# EasyEDA Pro project ProDocument_LTC2220_ADA_V1_2025-01-04.epro

# Schematic Schematic1
Create Date: 2023-09-23; Page Name: P1; Project Name: STI_Project; Schematic Name: Schematic1; Update Date: 2023-11-09; Company: 嘉立创EDA; Page Size: A4; Version: V1.0
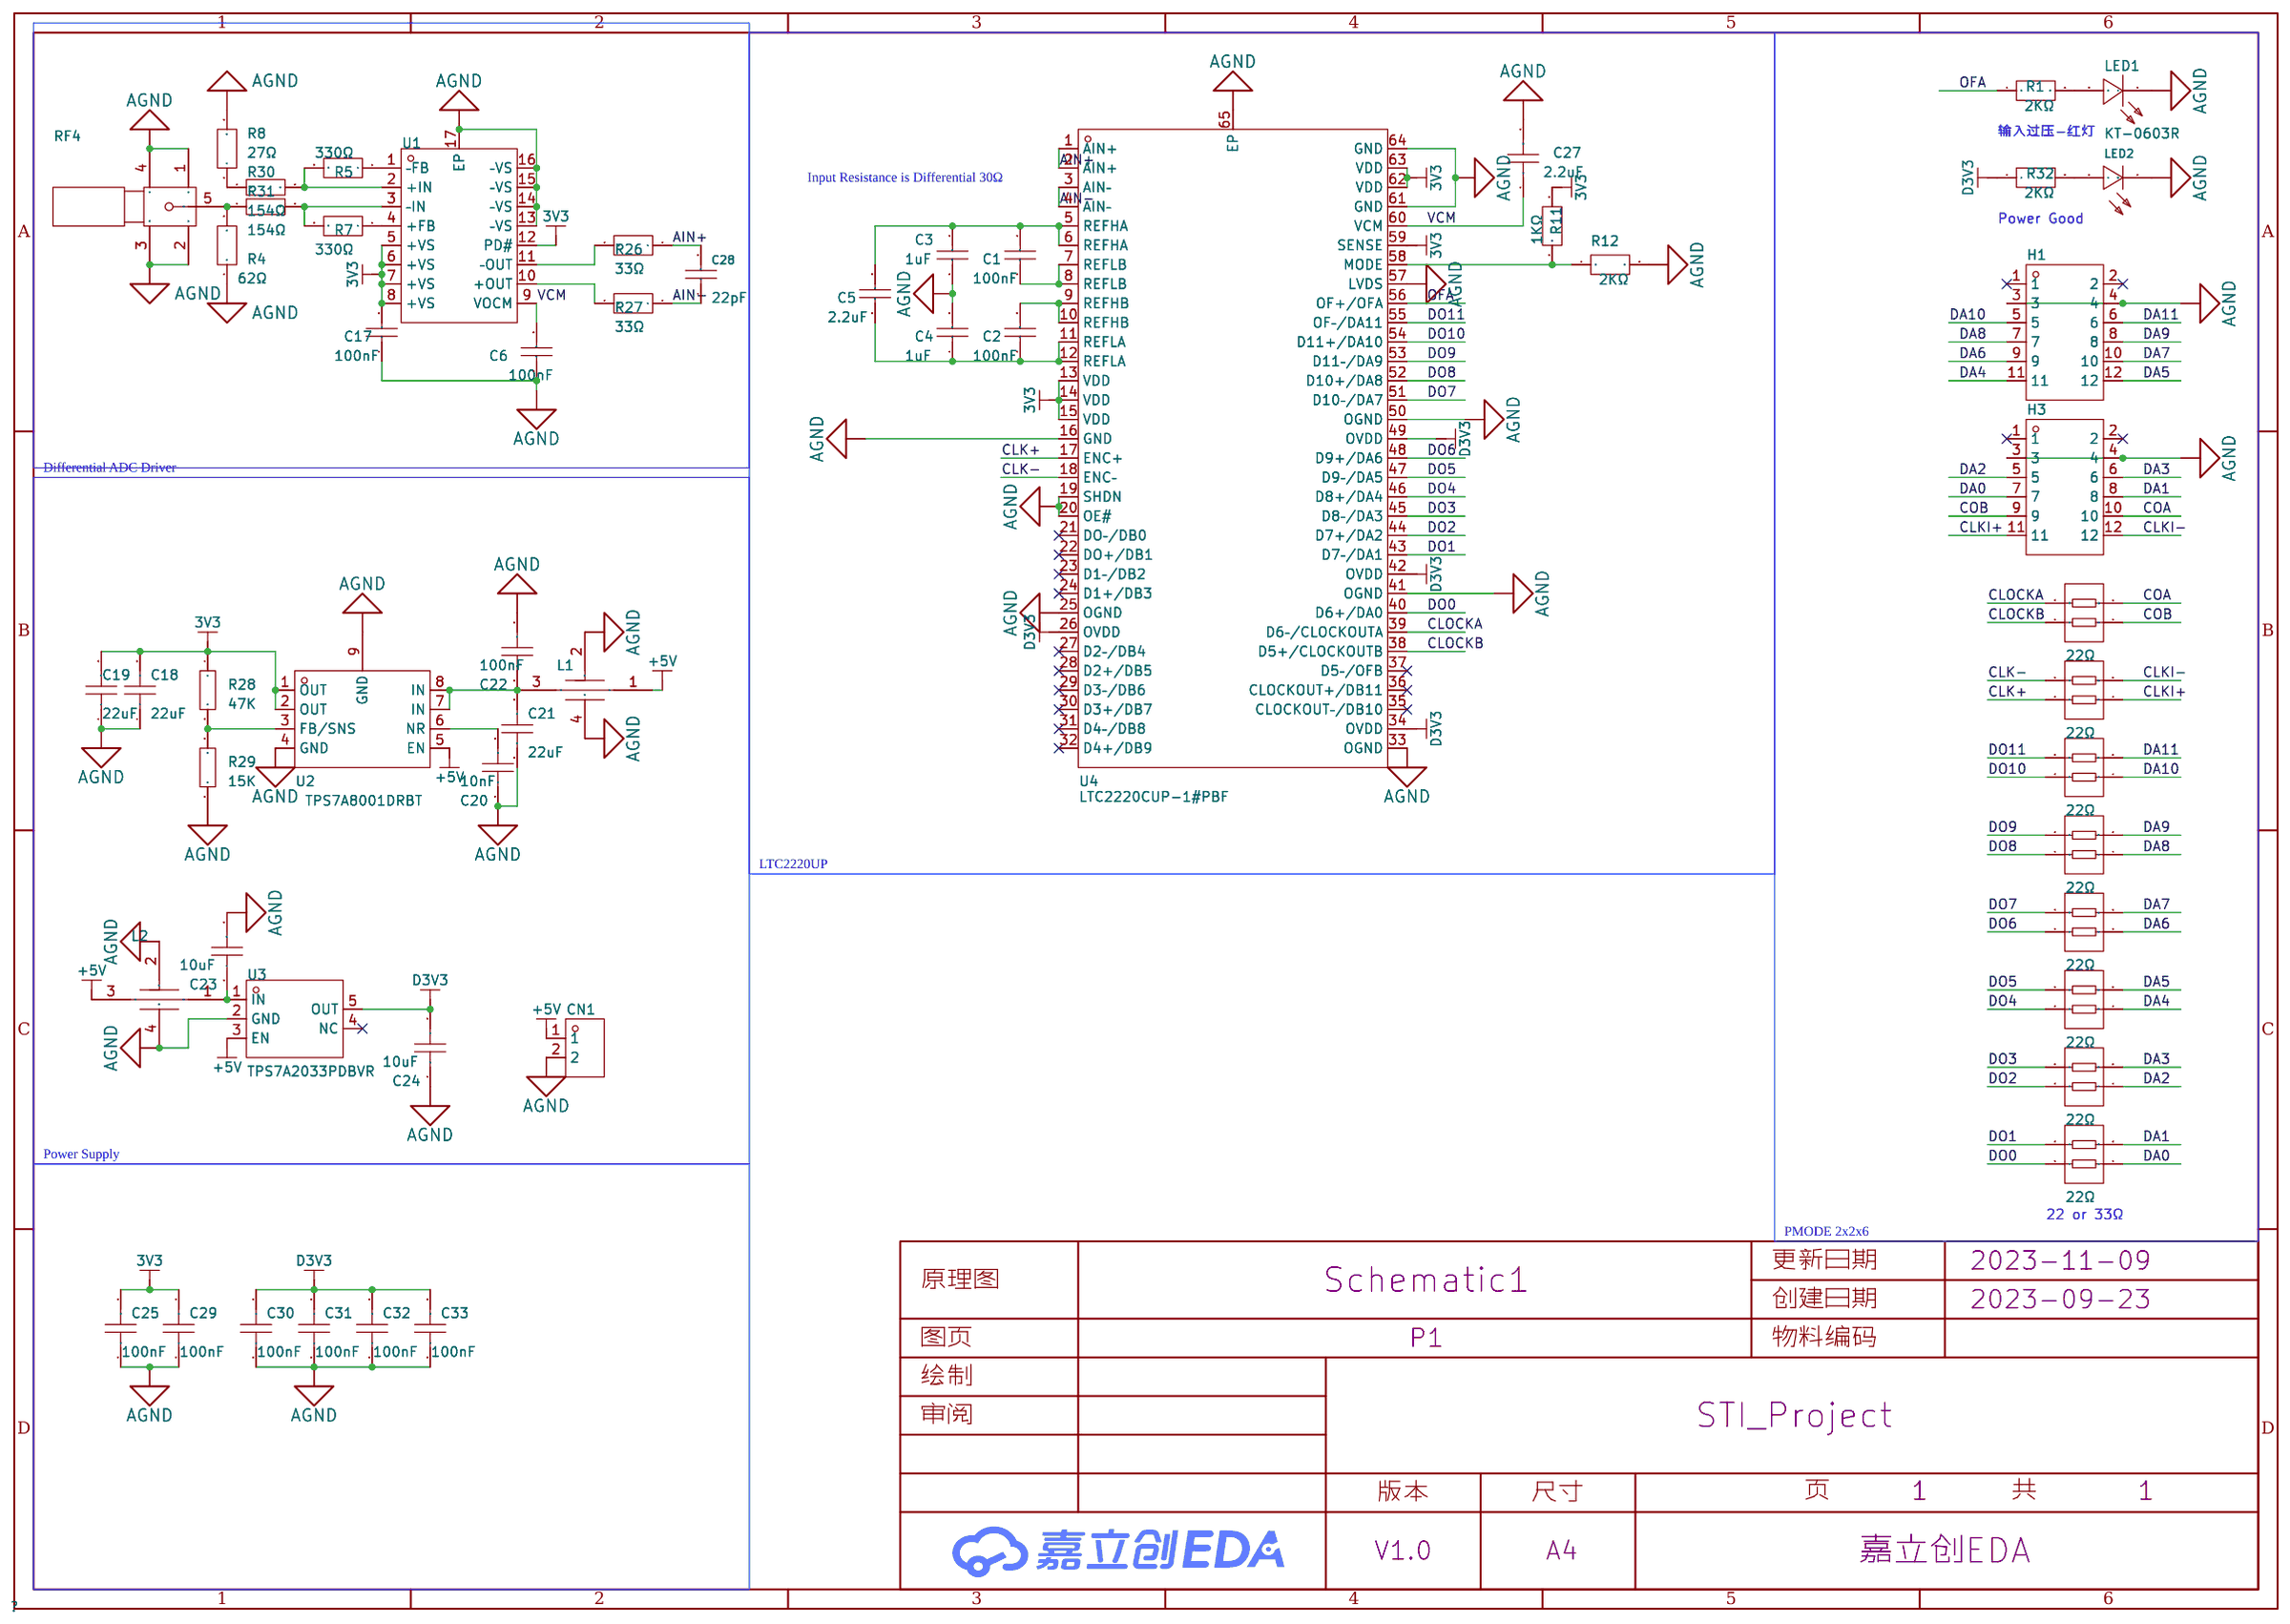
[diagram p0: schematic sheet]

## Parts
C1  100nF  [C0402]
C2  100nF  [C0402]
C3  1uF  [C0402]
C4  1uF  [C0402]
C5  2.2uF  [C0402]
C6  100nF  [C0402]
C17  100nF  [C0402]
C18  22uF  [C0805]
C19  22uF  [C0805]
C20  10nF  [C0603]
C21  22uF  [C0805]
C22  100nF  [C0603]
C23  10uF  [C0603]
C24  10uF  [C0603]
C25  100nF  [C0402]
C27  2.2uF  [C0603]
C28  22pF  [C0402]
C29  100nF  [C0402]
C30  100nF  [C0402]
C31  100nF  [C0402]
C32  100nF  [C0402]
C33  100nF  [C0402]
CN1  M2510V-02P  [CONN-TH_M2510V-02P]
H1  DZ254W-22-12-69  [HDR-TH_12P-P2.54-H-M-R2-C6-S2.54-W12.5]
H3  DZ254W-22-12-69  [HDR-TH_12P-P2.54-H-M-R2-C6-S2.54-W12.5]
L1  NFM21PC104R1E3D  [CAP-SMD_4P-L2.0-W1.25]
L2  NFM21PC104R1E3D  [CAP-SMD_4P-L2.0-W1.25]
LED1  KT-0603R  [LED0603-RD]
LED2  19-217/GHC-YR1S2/3T  [LED0603-RD]
R1  2KΩ  [R0402]
R4  62Ω  [R0402]
R5  330Ω  [R0402]
R7  330Ω  [R0402]
R8  27Ω  [R0402]
R11  1KΩ  [R0402]
R12  2KΩ  [R0402]
R26  33Ω  [R0402]
R27  33Ω  [R0402]
R28  47K  [R0402]
R29  15K  [R0402]
R30  154Ω  [R0402]
R31  154Ω  [R0402]
R32  2KΩ  [R0402]
RF4  KH-SMA-KE5.4  [SMA-TH_KH-SMA-KE-Z]
RN1  22Ω  [RES-ARRAY-SMD_0402-4P-L1.0-W1.0-BL]
RN2  22Ω  [RES-ARRAY-SMD_0402-4P-L1.0-W1.0-BL]
RN3  22Ω  [RES-ARRAY-SMD_0402-4P-L1.0-W1.0-BL]
RN4  22Ω  [RES-ARRAY-SMD_0402-4P-L1.0-W1.0-BL]
RN5  22Ω  [RES-ARRAY-SMD_0402-4P-L1.0-W1.0-BL]
RN6  22Ω  [RES-ARRAY-SMD_0402-4P-L1.0-W1.0-BL]
RN7  22Ω  [RES-ARRAY-SMD_0402-4P-L1.0-W1.0-BL]
RN8  22Ω  [RES-ARRAY-SMD_0402-4P-L1.0-W1.0-BL]
U1  ADA4937-1YCPZ-RL  [LFCSP-16_L3.0-W3.0-P0.50-BL-EP1.3]
U2  TPS7A8001DRBT  [SON-8_L3.0-W3.0-P0.65-BL-EP]
U3  TPS7A2033PDBVR  [SOT-23-5_L2.9-W1.6-P0.95-LS2.8-BR]
U4  LTC2220CUP-1#PBF  [QFN-64_L9.0-W9.0-P0.50-BL-EP7.2]

## Library data of the parts
C1-C6 C17 = GCM155R71C104KA40D: 容值:100nF;精度:±10%;额定电压:16V;材质(温度系数):X7R;; LCSC Part Name: 100nF ±10% 16V; Supplier Part: C126523; Manufacturer: muRata(村田); Supplier Footprint: 0402; JLCPCB Part Class: Extended Part; Datasheet: https://atta.szlcsc.comnull; Supplier: LCSC; Tolerance: ±10%; Voltage Rated: 16V; Temperature Coefficient: X7R
C18 C19 C21 = CL21A226MAQNNNE_C45783: 容值:22uF;精度:±20%;额定电压:25V;材质(温度系数):X5R;; LCSC Part Name: 22uF ±20% 25V; Supplier Part: C45783; Manufacturer: SAMSUNG(三星); Manufacturer Part: CL21A226MAQNNNE; Supplier Footprint: 0805; JLCPCB Part Class: 基础库; Datasheet: https://atta.szlcsc.com/upload/public/pdf/source/20160103/1457707727161.pdf; Supplier: LCSC; Tolerance: ±20%; Voltage Rated: 25V; Temperature Coefficient: X5R
C20 C22-C24 C27 = CAP_0603: Supplier Footprint: 0603
C25 C29-C33 = CAP_0402: Supplier Footprint: 0402
C28 = 0402CG220J500NT: 容值:22pF;精度:±5%;额定电压:50V;材质(温度系数):C0G;; LCSC Part Name: 22pF ±5% 50V; Supplier Part: C1555; Manufacturer: FH(风华); Supplier Footprint: 0402; JLCPCB Part Class: 基础库; Datasheet: https://atta.szlcsc.com/upload/public/pdf/source/20200305/C486355_26A10D38EF8C2A5C37091D0039909270.pdf; Supplier: LCSC; Tolerance: ±5%; Voltage Rated: 50V; Temperature Coefficient: C0G
CN1 = M2510V-02P: 参考系列:-;间距:2.54mm;插针结构:1x2P;排数:1;每排PIN数:2;行距:-;公母:公型插针;安装方式:直插;额定电流:3A;工作温度范围:-25~+85;; LCSC Part Name: 2P 2.54mm; Supplier Part: C2764790; Manufacturer: XFCN(台湾兴飞); Supplier Footprint: 插件,P=2.54mm; JLCPCB Part Class: Extended Part; Datasheet: https://atta.szlcsc.com/upload/public/pdf/source/20210810/3DC46818253F58AEF0903D89F89BDDDF.pdf; Supplier: LCSC; Pitch: 2.54mm; Pins Structure: 1x2P; Number of Rows: 1; Number of PINs Per Row: 2; Gender: 公型插针; Mounting Style: 直插; Current Rating (Max): 3A; Operating Temperature Range: -25~+85
H1 H3 = DZ254W-22-12-69: 间距:2.54mm;总PIN位数:12;排数:2;插针结构:2x6P;行距:2.54mm;安装类型:弯插;圆针/方针:方针;额定电流:3A;额定电压:-;配合针长度:6mm;塑高:2.54mm;端接针长度:-;工作温度范围:-;颜色:-;; LCSC Part Name: 2.54mm 2x6P 弯插 方针; Supplier Part: C2935938; Manufacturer: DEALON(德艺隆); Supplier Footprint: 弯插,P=2.54mm; JLCPCB Part Class: Extended Part; Datasheet: https://atta.szlcsc.com/upload/public/pdf/source/20211231/A9EB3FEFD92C329C455814A6A34A72A7.pdf; Supplier: LCSC; Pitch: 2.54mm; Number of Pins: 12; Number of Rows: 2; Pin Structure: 2x6P; Row Spacing: 2.54mm; Mounting Type: 弯插; Circluar Pins/Square Pins: 方针; Current Rating (Max): 3A; Length of Mating Pin: 6mm; Insulation Height: 2.54mm
L1 L2 = NFM21PC104R1E3D: 电容量:100nF;精度:±20%;直流电阻:30mΩ;; LCSC Part Name: 100nF(104) ±20% 25V; Supplier Part: C86150; Manufacturer: muRata(村田); Supplier Footprint: 0805; JLCPCB Part Class: 扩展库; Datasheet: https://atta.szlcsc.com/upload/public/pdf/source/20180326/C86150_E4B7366323682FA84DED9003C68CA797.pdf; Supplier: LCSC; Nominal Capacitance: 100nF; CapacitanceTolerance: ±20%; DC Rated Voltage: 25V; Rated Current: 2A; DC Resistance: 30mΩ; Operating Temperature: -55℃~+125℃
LED1 = KT-0603R: 发光颜色:红灯;二极管配置:-;透镜颜色:-;主波长:-;色温:-;功率:-;发光角度:-;安装方式:-;工作温度:-40℃~+85℃;; LCSC Part Name: 0603 红灯 高亮; Supplier Part: C2286; Manufacturer: KENTO; Supplier Footprint: 0603; JLCPCB Part Class: 基础库; Datasheet: https://atta.szlcsc.com/upload/public/pdf/source/20160616/1466072038404.pdf; Supplier: LCSC; Emitted Color: 红灯; Operating Temperature: -40℃~+85℃
LED2 = 19-217/GHC-YR1S2/3T: 发光颜色:翠绿;二极管配置:-;主波长:520nm~535nm;色温:-;功率:110mW;安装方式:-;; LCSC Part Name: 翠绿; Supplier Part: C72043; Manufacturer: EVERLIGHT(亿光); Supplier Footprint: 0603; JLCPCB Part Class: 基础库; Datasheet: https://atta.szlcsc.com/upload/public/pdf/source/20160507/1462613613780.pdf; Supplier: LCSC; Emitted Color: 翠绿; Lens Color: 无色透明; Dominant Wavelength: 520nm~535nm; Peak Wavelength: 518nm; Forward Current: 20mA; Power Dissipation: 110mW; Viewing Angle: 120°; Operating Temperature: -40℃~+85℃
R1 R4 R5 R7 R8 R11 R12 R26 R27 R32 = ARG02BTC1001: 阻值:1kΩ;精度:±0.1%;温度系数:±25ppm/;; LCSC Part Name: 1kΩ ±0.1%; Supplier Part: C2984405; Manufacturer: Viking(光颉); Supplier Footprint: 0402; Datasheet: https://atta.szlcsc.com/upload/public/pdf/source/20200117/C485675_99063924B4564AF910B7BE66DA8EFA49.pdf; Supplier: LCSC; Tolerance: ±0.1%; Temperature Coefficient: ±25ppm/
R28 R29 = Res_0402: Supplier Footprint: 0402
R30 R31 = AC0402FR-07154RL: 电阻类型:厚膜电阻;阻值:154Ω;精度:±1%;功率:62.5mW;; LCSC Part Name: 154Ω ±1% 62.5mW; Supplier Part: C226792; Manufacturer: YAGEO(国巨); Supplier Footprint: 0402; JLCPCB Part Class: 扩展库; Datasheet: https://atta.szlcsc.com/upload/public/pdf/source/20180927/C226792_CA4154DF169955A8D57D7DD1AB6791E3.pdf; Supplier: LCSC; Type: 厚膜电阻; Tolerance: ±1%; Power(Watts): 62.5mW; Temperature Coefficient: ±100ppm/℃; Overload Voltage (Max): 50V; Operating Temperature Range: -55℃~+155℃
RF4 = KH-SMA-KE5.4: SMA板端 SMA板端 镀金半牙正脚直插SMA母针板端L=16.8MM 牙长5.4MM; LCSC Part Name: SMA板端; Supplier Part: C5123111; Manufacturer: kinghelm(金航标); Datasheet: https://atta.szlcsc.com/upload/public/pdf/source/20220804/C995CCD46EDCE61B12815CDE505A137A.pdf; Supplier: LCSC
RN1-RN8 = 2D02WGF220JTCE: 阻值:22Ω;精度:±1%;单个元件功率:62.5mW;电阻器数:2;; LCSC Part Name: 22Ω ±1%; Supplier Part: C425360; Manufacturer: UNI-ROYAL(厚声); Supplier Footprint: 0402x2; JLCPCB Part Class: 扩展库; Datasheet: https://atta.szlcsc.com/upload/public/pdf/source/20190904/C425360_E9826517C193614D673ACACE9EAE53D9.pdf; Supplier: LCSC; Tolerance: ±1%; Power(Watts): 62.5mW; Number of Resistors: 2; Number of Pins: 4; Temperature Coefficient: ±200ppm/℃
U1 = ADA4937-1YCPZ-RL: ADC-驱动器-IC-数据采集-16-LFCSP-VQ（3x3）; Supplier Part: C654331; Manufacturer: ADI(亚德诺)/LINEAR; Supplier Footprint: LFCSP-16; JLCPCB Part Class: Extended Part; Datasheet: https://atta.szlcsc.com/upload/public/pdf/source/20220519/FA46AECF95EBC5BF60D11754C6F695C9.pdf; Supplier: LCSC
U2 = TPS7A8001DRBT: 输出类型:可调;输出极性:正;输出通道数:1;最大输入电压:6.5V;输出电压:0.8V~6V;压差:500mV@(1A);输出电流:1A;电源纹波抑制比(PSRR):63dB;; LCSC Part Name: 正 Vin=6.5V Vout=0.8V~6V 1A 63dB; Supplier Part: C427118; Manufacturer: TI(德州仪器); Supplier Footprint: SON-8; Datasheet: https://atta.szlcsc.com/upload/public/pdf/source/20190909/C427118_0994F850269DFD43F93363C66176E2B6.pdf; Supplier: LCSC; Output Type: 可调; Output Polarity: 正; Number of Outputs: 1; Maximum Input Voltage: 6.5V; Output Voltage: 0.8V~6V; Dropout Voltage: 500mV@(1A); Output Current: 1A; Power Supply Rejection Ratio (PSRR): 63dB
U3 = TPS7A2033PDBVR: Supplier Part: C2862740; Manufacturer: TI(德州仪器); Supplier Footprint: SOT-23-5; JLCPCB Part Class: 扩展库; Datasheet: https://atta.szlcsc.com/upload/public/pdf/source/20230221/9B73099824E408F4B24BD95C528A27ED.pdf; Supplier: LCSC
U4 = LTC2220CUP-1#PBF: A/D 位数:-;采样率（sps）:-;输入数:-;输入类型:-;; Supplier Part: C679555; Manufacturer: ADI(亚德诺)/LINEAR; Supplier Footprint: QFN-64; JLCPCB Part Class: 扩展库; Datasheet: https://atta.szlcsc.com/upload/public/pdf/source/20200820/C679555_F0847BF44789C8E170D57E90645020CF.pdf; Supplier: LCSC

## Nets
3V3: C17.2 C18.2 C19.2 C25.2 C29.2 R11.1 R28.1 U1.5(+VS) U1.6(+VS) U1.7(+VS) U1.8(+VS) U1.12(PD#) U2.1(OUT) U2.2(OUT) U4.13(VDD) U4.14(VDD) U4.15(VDD) U4.59(SENSE) U4.62(VDD) U4.63(VDD)
+5V: CN1.1 L1.1(IN) L2.3(OUT) U2.5(EN) U3.3(EN)
AGND: C3.1 C4.2 C6.1 C17.1 C18.1 C19.1 C20.1 C21.1 C22.2 C23.2 C24.1 C25.1 C27.2 C29.1 C30.1 C31.1 C32.1 C33.1 CN1.2 H1.3 H1.4 H3.3 H3.4 L1.2(GND) L1.4(GND) L2.2(GND) L2.4(GND) LED1.1(K) LED2.1(C) R4.1 R8.2 R12.2 R29.2 RF4.1 RF4.2 RF4.3 RF4.4 U1.13(–VS) U1.14(–VS) U1.15(–VS) U1.16(–VS) U1.17(EP) U2.4(GND) U2.9(GND) U3.2(GND) U4.16(GND) U4.19(SHDN) U4.20(OE#) U4.25(OGND) U4.33(OGND) U4.41(OGND) U4.50(OGND) U4.57(LVDS) U4.61(GND) U4.64(GND) U4.65(EP)
D3V3: C24.2 C30.2 C31.2 C32.2 C33.2 R32.1 U3.5(OUT) U4.26(OVDD) U4.34(OVDD) U4.42(OVDD) U4.49(OVDD)
AIN+: C28.2 R26.1 U4.1(AIN+) U4.2(AIN+)
AIN-: C28.1 R27.1 U4.3(AIN–) U4.4(AIN–)
CLK+: RN2.1 U4.17(ENC+)
CLK-: RN2.2 U4.18(ENC–)
CLKI+: H3.11 RN2.4
CLKI-: H3.12 RN2.3
CLOCKA: RN8.2 U4.39(D6–/CLOCKOUTA)
CLOCKB: RN8.1 U4.38(D5+/CLOCKOUTB)
COA: H3.10 RN8.3
COB: H3.9 RN8.4
DA0: H3.7 RN7.4
DA1: H3.8 RN7.3
DA2: H3.5 RN6.4
DA3: H3.6 RN6.3
DA4: H1.11 RN5.4
DA5: H1.12 RN5.3
DA6: H1.9 RN4.4
DA7: H1.10 RN4.3
DA8: H1.7 RN3.4
DA9: H1.8 RN3.3
DA10: H1.5 RN1.4
DA11: H1.6 RN1.3
DO0: RN7.1 U4.40(D6+/DA0)
DO1: RN7.2 U4.43(D7–/DA1)
DO2: RN6.1 U4.44(D7+/DA2)
DO3: RN6.2 U4.45(D8–/DA3)
DO4: RN5.1 U4.46(D8+/DA4)
DO5: RN5.2 U4.47(D9–/DA5)
DO6: RN4.1 U4.48(D9+/DA6)
DO7: RN4.2 U4.51(D10–/DA7)
DO8: RN3.1 U4.52(D10+/DA8)
DO9: RN3.2 U4.53(D11–/DA9)
DO10: RN1.1 U4.54(D11+/DA10)
DO11: RN1.2 U4.55(OF–/DA11)
OFA: R1.1 U4.56(OF+/OFA)
VCM: C6.2 C27.1 U1.9(VOCM) U4.60(VCM)
$1N11576: C1.1 U4.7(REFLB) U4.8(REFLB)
$1N11577: C2.2 U4.9(REFHB) U4.10(REFHB)
$1N11578: C1.2 C3.2 C5.2 U4.5(REFHA) U4.6(REFHA)
$1N11579: C2.1 C4.1 C5.1 U4.11(REFLA) U4.12(REFLA)
$1N11586: R5.1 U1.1(–FB)
$1N11587: R5.2 R30.2 U1.2(+IN)
$1N11588: R7.1 U1.4(+FB)
$1N11590: R7.2 R31.2 U1.3(–IN)
$1N11617: R11.2 R12.1 U4.58(MODE)
$1N11646: R4.2 R31.1 RF4.5
$1N11649: R27.2 U1.10(+OUT)
$1N11650: R26.2 U1.11(–OUT)
$1N12931: C21.2 C22.1 L1.3(OUT) U2.7(IN) U2.8(IN)
$1N13030: R28.2 R29.1 U2.3(FB/SNS)
$1N13493: C20.2 U2.6(NR)
$1N13643: C23.1 L2.1(IN) U3.1(IN)
$1N14199: R8.1 R30.1
$1N14652: LED1.2(A) R1.2
$1N14739: LED2.2(A) R32.2

Not connected (* = marked no-connect by the designer): H1 1* 2*; H3 1* 2*; U3 4(NC)*; U4 21(DO–/DB0)* 22(DO+/DB1)* 23(D1–/DB2)* 24(D1+/DB3)* 27(D2–/DB4)* 28(D2+/DB5)* 29(D3–/DB6)* 30(D3+/DB7)* 31(D4–/DB8)* 32(D4+/DB9)* 35(CLOCKOUT–/DB10)* 36(CLOCKOUT+/DB11)* 37(D5–/OFB)*

## Notes on the sheet
- 输入过压-红灯
- Input Resistance is Differential 30Ω
- Power Good
- Differential ADC Driver
- LTC2220UP
- Power Supply
- 22 or 33Ω
- PMODE 2x2x6

# Board PCB1
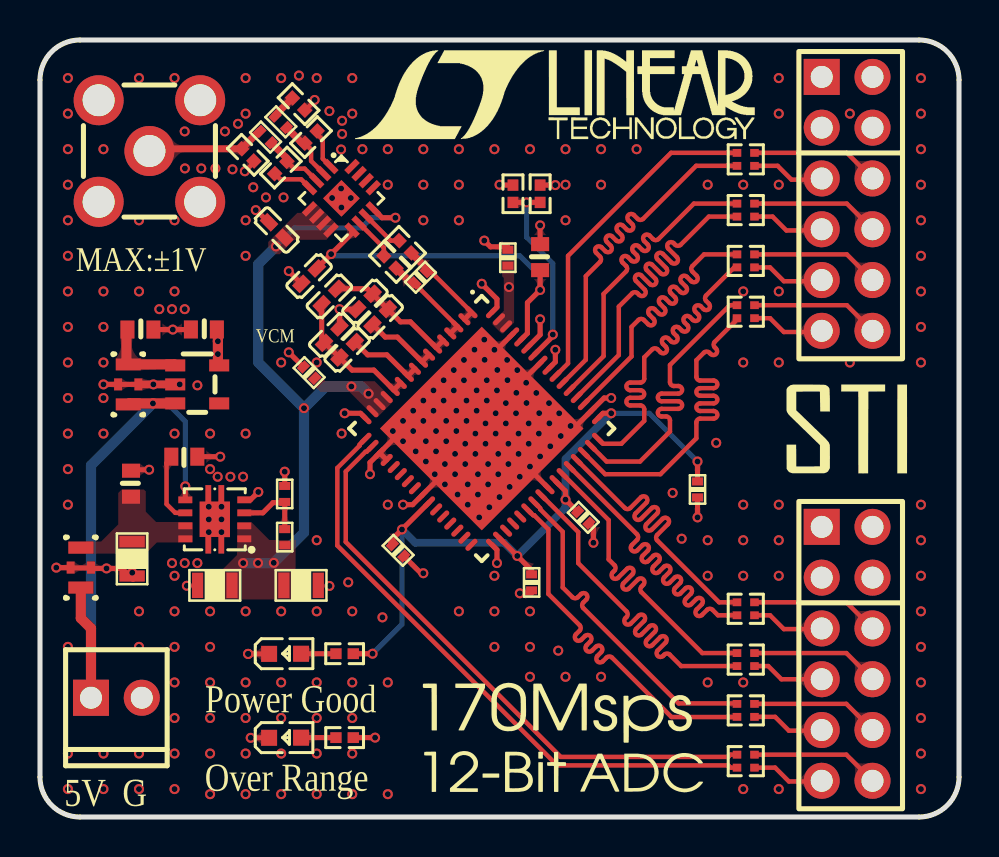
[diagram p1: board, top side]
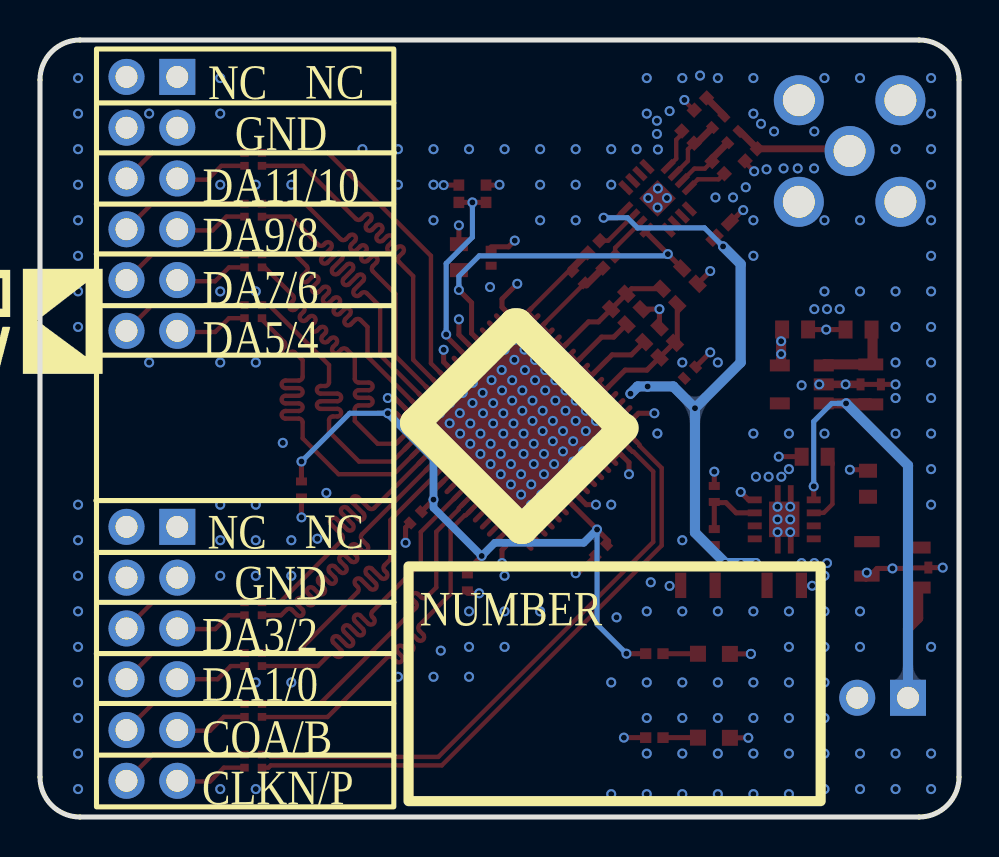
[diagram p2: board, bottom side, seen from below]

Outline 45.97 x 38.86 mm; copper layers: Top Layer, Inner1, Inner2, Bottom Layer. Coordinates in mm from the lower left corner of the outline.
Outline path: 0,36.86 0,2 arc(0.59,0.59) 2,0 43.97,0 arc(45.39,0.59) 45.97,2 45.97,36.86 arc(45.39,38.28) 43.97,38.86 2,38.86 arc(0.59,38.28) 0,36.86
Stack: Top Layer 0.035mm 外层铜厚1oz / Dielectric1 0.2104mm 7628 RC49% 8.6mil / Inner1 0.0152mm 内层铜厚 / Dielectric2 1.065mm 1.1mm H/HOZ 含铜 / Inner2 0.0152mm 内层铜厚 / Dielectric3 0.2104mm 7628 RC49% 8.6mil / Bottom Layer 0.035mm 外层铜厚1oz

## Design rules (mm)
net AIN+: AIN
net AIN-: AIN
template: 自定义配置
spacing copperThickness1oz (default): track to track 0.102, other pairs 0.152 to 0.3
spacing copperThickness2oz: track to track 0.203, other pairs 0.152 to 0.3
track width copperThickness1oz (default): min 0.127, default 0.254, max 2.54
track width copperThickness2oz: min 0.203, default 0.254, max 2.54
differential pair differentialPair (default): width min 0.127, default 0.221, max 2.54; gap min 0.203, default 0.203
via viaSize (default): diameter min 0.399, default 0.5, max 10; hole min 0.3, default 0.3, max 6.299

## Placement (name value [footprint] x y rotation side)
C1  100nF  [C0402#2]  17.02 25.02 45 top
C2  100nF  [C0402#2]  15.37 23.37 45 top
C3  1uF  [C0402#2]  16.26 25.78 45 top
C4  1uF  [C0402#2]  14.6 24.1 45 top
C5  2.2uF  [C0402#2]  14.48 26.04 45 top
C6  100nF  [C0402#2]  13.46 27.05 45 top
C17  100nF  [C0402#2]  11.84 29.36 315 top
C18  22uF  [C0805]  13.06 11.59 180 top
C19  22uF  [C0805]  8.74 11.59 0 top
C20  10nF  [C0603]  7.22 18.02 180 top
C21  22uF  [C0805]  4.61 12.91 90 top
C22  100nF  [C0603]  4.55 16.67 90 top
C23  10uF  [C0603]  5.02 24.38 0 top
C24  10uF  [C0603]  8.2 24.38 0 top
C25  100nF  [C0402]  13.46 22.23 315 top
C27  2.2uF  [C0603]  25.02 28 90 top
C28  22pF  [C0402]  19.03 27 45 top
C29  100nF  [C0402]  23.41 27.97 270 top
C30  100nF  [C0402]  27.18 14.99 135 top
C31  100nF  [C0402]  24.59 11.73 90 top
C32  100nF  [C0402]  32.89 16.38 90 top
C33  100nF  [C0402]  17.91 13.34 135 top
CN1  M2510V-02P  [CONN-TH_M2510V-02P]  3.82 5.96 180 top
H1  DZ254W-22-12-69  [HDR-TH_12P-P2.54-H-M-R2-C6-S2.54-W12.5]  40.38 30.67 90 top
H3  DZ254W-22-12-69  [HDR-TH_12P-P2.54-H-M-R2-C6-S2.54-W12.5]  40.38 8.16 90 top
L1  NFM21PC104R1E3D  [CAP-SMD_4P-L2.0-W1.25]  2.04 12.48 90 top
L2  NFM21PC104R1E3D  [CAP-SMD_4P-L2.0-W1.25]  4.42 21.64 270 top
LED1  KT-0603R  [LED0603-RD]  12.26 3.97 0 top
LED2  19-217/GHC-YR1S2/3T  [LED0603-RD]  12.26 8.16 0 top
R1  2KΩ  [R0402#2]  15.24 3.97 180 top
R4  62Ω  [R0402#2]  10.4 33.12 135 top
R5  330Ω  [R0402#2]  13.56 34.01 225 top
R7  330Ω  [R0402#2]  12.05 32.48 45 top
R8  27Ω  [R0402#2]  12.94 35.66 315 top
R11  1KΩ  [R0402#2]  23.66 31.17 270 top
R12  2KΩ  [R0402#2]  25.02 31.17 90 top
R26  33Ω  [R0402#2]  18.27 28.52 135 top
R27  33Ω  [R0402#2]  17.51 27.76 135 top
R28  47K  [R0402]  12.24 14 90 top
R29  15K  [R0402]  12.24 16.16 90 top
R30  154Ω  [R0402]  12.05 34.77 315 top
R31  154Ω  [R0402]  11.29 34.01 315 top
R32  2KΩ  [R0402#2]  15.24 8.17 180 top
RF4  KH-SMA-KE5.4  [SMA-TH_KH-SMA-KE-Z]  5.47 33.31 0 top
RN1  22Ω  [RES-ARRAY-SMD_0402-4P-L1.0-W1.0-BL]  35.31 32.89 0 top
RN2  22Ω  [RES-ARRAY-SMD_0402-4P-L1.0-W1.0-BL]  35.31 2.79 0 top
RN3  22Ω  [RES-ARRAY-SMD_0402-4P-L1.0-W1.0-BL]  35.31 30.35 0 top
RN4  22Ω  [RES-ARRAY-SMD_0402-4P-L1.0-W1.0-BL]  35.31 27.81 0 top
RN5  22Ω  [RES-ARRAY-SMD_0402-4P-L1.0-W1.0-BL]  35.31 25.27 0 top
RN6  22Ω  [RES-ARRAY-SMD_0402-4P-L1.0-W1.0-BL]  35.31 10.41 0 top
RN7  22Ω  [RES-ARRAY-SMD_0402-4P-L1.0-W1.0-BL]  35.31 7.87 0 top
RN8  22Ω  [RES-ARRAY-SMD_0402-4P-L1.0-W1.0-BL]  35.31 5.33 0 top
U1  ADA4937-1YCPZ-RL  [LFCSP-16_L3.0-W3.0-P0.50-BL-EP1.3]  15.08 30.94 225 top
U2  TPS7A8001DRBT  [SON-8_L3.0-W3.0-P0.65-BL-EP]  8.74 14.89 90 top
U3  TPS7A2033PDBVR  [SOT-23-5_L2.9-W1.6-P0.95-LS2.8-BR]  7.86 21.64 180 top
U4  LTC2220CUP-1#PBF  [QFN-64_L9.0-W9.0-P0.50-BL-EP7.2]  22.1 19.43 225 top

## Footprints (pads in the part's own frame, mm; a bottom-side part is the same pattern mirrored in y, then rotated)
C0402
  rect 0.4x0.55 smd: 1(-0.4,0) 2(0.4,0)
C0402#2
  rect 0.79x0.54 smd: 1(-0.545,0) 2(0.545,0)
C0603
  rect 0.7x0.9 smd: 1(-0.65,0) 2(0.65,0)
C0805
  rect 0.559x1.27 smd: 1(-0.86,0) 2(0.86,0)
CAP-SMD_4P-L2.0-W1.25
  rect 0.6x1.25 smd: 1(-1,0) 3(1,0)
  rect 0.6x0.4 smd: 2(0,-0.508) 4(0,0.508)
CONN-TH_M2510V-02P
  rect 1.801x1.801 hole 1.1: 1(1.27,0)
  round 1.801 hole 1.1: 2(-1.27,0)
HDR-TH_12P-P2.54-H-M-R2-C6-S2.54-W12.5
  rect 1.801x1.801 hole 1.1: 1(6.35,1.27)
  round 1.801 hole 1.1: 2(6.35,-1.27) 3(3.81,1.27) 4(3.81,-1.27) 5(1.27,1.27) 6(1.27,-1.27) 7(-1.27,1.27) 8(-1.27,-1.27) 9(-3.81,1.27) 10(-3.81,-1.27) 11(-6.35,1.27) 12(-6.35,-1.27)
LED0603-RD
  rect 0.8x0.8 smd: 1(-0.799,-0.004) 2(0.799,0.004)
LFCSP-16_L3.0-W3.0-P0.50-BL-EP1.3
  rect 0.3x0.8 smd: 1(-0.75,-1.5) 2(-0.25,-1.5) 3(0.25,-1.5) 4(0.75,-1.5) 9(0.75,1.5) 10(0.25,1.5) 11(-0.25,1.5) 12(-0.75,1.5)
  rect 0.8x0.3 smd: 5(1.5,-0.75) 6(1.5,-0.25) 7(1.5,0.25) 8(1.498,0.751) 13(-1.5,0.75) 14(-1.5,0.25) 15(-1.5,-0.25) 16(-1.5,-0.75)
  rect 1.3x1.3 smd: 17(0,0)
QFN-64_L9.0-W9.0-P0.50-BL-EP7.2
  oval 0.25x0.75 smd: 1(-3.75,-4.475) 2(-3.25,-4.475) 3(-2.75,-4.475) 4(-2.25,-4.475) 5(-1.75,-4.475) 6(-1.25,-4.475) 7(-0.75,-4.475) 8(-0.25,-4.475) 9(0.25,-4.475) 10(0.75,-4.475) 11(1.25,-4.475) 12(1.75,-4.475) 13(2.25,-4.475) 14(2.75,-4.475) 15(3.25,-4.475) 16(3.75,-4.475) 33(3.75,4.475) 34(3.25,4.475) 35(2.75,4.475) 36(2.25,4.475) 37(1.75,4.475) 38(1.25,4.475) 39(0.75,4.475) 40(0.25,4.475) 41(-0.25,4.475) 42(-0.75,4.475) 43(-1.25,4.475) 44(-1.75,4.475) 45(-2.25,4.475) 46(-2.75,4.475) 47(-3.25,4.475) 48(-3.75,4.475)
  oval 0.75x0.25 smd: 17(4.475,-3.75) 18(4.475,-3.25) 19(4.475,-2.75) 20(4.475,-2.25) 21(4.475,-1.75) 22(4.475,-1.25) 23(4.475,-0.75) 24(4.475,-0.25) 25(4.475,0.25) 26(4.475,0.75) 27(4.475,1.25) 28(4.475,1.75) 29(4.475,2.25) 30(4.475,2.75) 31(4.475,3.25) 32(4.475,3.75) 49(-4.475,3.75) 50(-4.475,3.25) 51(-4.475,2.75) 52(-4.475,2.25) 53(-4.475,1.75) 54(-4.475,1.25) 55(-4.475,0.75) 56(-4.475,0.25) 57(-4.475,-0.25) 58(-4.475,-0.75) 59(-4.475,-1.25) 60(-4.475,-1.75) 61(-4.475,-2.25) 62(-4.475,-2.75) 63(-4.475,-3.25) 64(-4.475,-3.75)
  rect 7.2x7.2 smd: 65(0.001,0)
R0402
  rect 0.4x0.55 smd: 1(-0.4,0) 2(0.4,0)
R0402#2
  rect 0.566x0.54 smd: 1(-0.433,0) 2(0.433,0)
RES-ARRAY-SMD_0402-4P-L1.0-W1.0-BL
  rect 0.425x0.39 smd: 1(-0.438,-0.325) 2(-0.438,0.325) 3(0.438,0.325) 4(0.438,-0.325)
SMA-TH_KH-SMA-KE-Z
  round 2.5 hole 1.6: 1(-2.54,-2.54) 2(-2.54,2.54) 3(2.54,2.54) 4(2.54,-2.54) 5(-0.001,0.001)
SON-8_L3.0-W3.0-P0.65-BL-EP
  rect 0.34x0.7 smd: 1(-0.976,-1.476) 2(-0.325,-1.476) 3(0.325,-1.476) 4(0.976,-1.476) 5(0.976,1.476) 6(0.325,1.476) 7(-0.325,1.476) 8(-0.976,1.476)
  custom 3.42x1.52 smd: 9(0.005,0)
SOT-23-5_L2.9-W1.6-P0.95-LS2.8-BR
  rect 1x0.6 smd: 1(1.1,-0.95) 2(1.1,0) 3(1.1,0.95) 4(-1.1,0.95) 5(-1.1,-0.95)

## Nets
As in the schematic.

Pads without a net: H1 1 2; H3 1 2; U3 4; U4 21 22 23 24 27 28 29 30 31 32 35 36 37

## Via types
v1: diameter 0.5, hole 0.3, Top Layer to Bottom Layer, 185 vias
v2: diameter 0.503, hole 0.299, Top Layer to Bottom Layer, 161 vias

## Routing (per net, layer and track width the routed paths; a pad name or vN(x,y) marks a point on that pad's centre or on a via; arc(x,y) is an arc through that point)
3V3: length 53.7
  Top Layer w0.254: v1(22.99,31.62) 23.01,31.6 R11.1 ; 16.67,30.41 17.11,29.97 v1(17.78,29.97) ; U4.59 25.02,24.12 v1(25.02,24.89)
  Inner2 w0.254: v1(25.02,24.89) 25.02,24.95 v1(23.46,26.51) 23.46,29.01 22.99,29.48 v1(22.99,31.62)
  Inner2 w0.381: v1(23.46,26.51) 22.95,26.51 21.84,25.4 18.16,25.4 v1(13.21,20.45)
  Bottom Layer w0.254: v1(17.78,29.97) 16.59,29.97 16.08,29.46 12.73,29.46 v1(11.8,28.54)
  Bottom Layer w0.508: v1(13.21,20.45) 14.29,21.53 v1(15.58,21.53) 16.07,21.53 v1(16.43,21.17) ; v1(13.21,20.45) 10.92,22.73 10.92,27.66 v1(11.8,28.54) ; v1(13.21,20.45) 13.21,14.23 v1(11.7,12.71) 11.68,12.7 v1(10.17,12.7)
  vias: v1(10.91,12.7)
+5V: length 30
  Top Layer w0.254: v1(7.27,16.54) U2.5
  Top Layer w0.508: L2.3 4.47,20.69 v1(5.65,20.69) U3.3 ; CN1.1 2.55,9.44 2.04,9.94 L1.1
  Bottom Layer w0.254: v1(5.65,20.69) 6.36,20.69 7.27,19.78 v1(7.27,16.54)
  Bottom Layer w0.508: v1(5.65,20.69) 2.55,17.59 CN1.1
AGND: length 65.6
  Top Layer w0.221: 13.28,35.37 13.75,35.84 13.77,35.84 ; 10.71,32.75 10.22,32.26 10.21,32.26
  Top Layer w0.254: 23.41,28.52 22.54,28.52 v1(22.23,28.83) ; 2.63,12.46 1.51,12.46 1.49,12.47 v1(0.82,12.47) ; 22.1,19.43 22.1,19.08 18.64,15.62 v1(18.16,15.62) ; 22.1,19.43 22.1,19.78 ; 22.1,19.43 22.45,19.43 ; U4.19 16.51,17.73 v1(16.51,17.15) ; U4.19 U4.20 ; U4.19 17.65,18.88 v1(17.65,19.3) v1(18.67,19.3) v1(19.81,19.3) v1(20.83,19.3) 21.97,19.3 U4.65 ; 24.59,11.19 v1(24,11.19) ; 32.89,15.84 v1(32.89,14.99) ; 7.92,18.02 v1(9.02,18.02) ; v1(27.69,13.72) 27.69,14.48 27.56,14.6 ; 18.3,12.95 19.06,12.19 v1(19.18,12.19) ; 7.5,24.38 7.49,24.38 v1(6.64,24.38) 5.72,24.38 ; 25.02,28.7 v1(25.02,29.59) ; 22.45,19.43 26.69,19.43 U4.50 28.22,20.96 v1(28.58,20.96) ; 22.45,19.43 U4.41 ; 10.22,15.86 10.53,15.86 v1(10.92,16.26) ; 22.1,19.78 22.1,22.61 U4.61 ; 22.1,19.78 25.09,22.77 ; C3.1 15.87,25.38 15.85,25.4 v1(14.99,25.4) 14.99,24.49 C4.2 ; 2.68,12.43 4.11,12.43 4.65,11.88 ; 12.24,16.59 v1(12.24,17.27) ; v1(22.86,12.7) 22.86,13.37 U4.33 ; 11.42,29.74 10.82,30.35 v1(10.8,30.35) ; C6.1 12.45,27.3 v1(12.45,27.31) ; U4.64 22.86,25.5 22.86,25.91 v1(22.1,26.67) ; 4.92,21.64 L2.2 v1(3.17,21.64) ; R12.2 v1(25.78,31.6) ; LED1.1 v1(10.54,3.96) ; U4.16 16.03,20.19 v1(15.24,20.19) ; LED2.1 v1(10.41,8.16) ; 13.08,22.61 v1(12.45,23.24) ; 4.55,17.37 v1(5.46,17.37)
  Top Layer w0.381: 4.92,21.64 v1(5.67,21.64) U3.2
  Bottom Layer w0.254: v1(9.02,18.02) 9.02,18.03
  vias: v1(3.33,12.43) v1(4.62,12.22) v1(5.97,25.4) v1(6.6,25.4) v1(6.6,12.7) v1(6.99,21.64) v1(7.24,34.29) v1(7.25,32.44) v1(7.24,25.4) v1(7.24,12.7) v1(7.35,11.57) v1(7.87,21.59) v1(7.87,12.7) v1(8.07,32.44) v1(8.44,15.52) v1(8.44,14.88) v1(8.44,14.25) v1(8.78,32.44) v1(8.89,17.02) v1(9.08,15.52) v1(9.08,14.88) v1(9.08,14.25) v1(9.25,34.29) v1(9.52,17.02) v1(9.63,32.39) v1(9.91,34.67) v1(10.16,17.02) v1(10.25,32.3) v1(11.3,30.99) v1(12.18,30.99) v1(13.74,35.86) v1(14.48,35.31) v1(14.48,11.56) v1(14.61,30.96) v1(15.06,33.39) v1(15.06,31.44) v1(15.11,34.82) v1(15.11,34.16) v1(15.08,30.49) v1(15.55,30.96) v1(18.16,19.81) v1(18.16,18.8) v1(18.67,20.32) v1(18.8,18.29) v1(19.18,20.83) v1(19.18,19.81) v1(19.3,18.8) v1(19.3,17.78) v1(19.69,21.34) v1(19.69,20.32) v1(19.75,17.15) v1(19.81,18.29) v1(20.19,21.84) v1(20.19,20.83) v1(20.26,17.65) v1(20.26,16.64) v1(20.32,19.81) v1(20.32,18.8) v1(20.7,22.35) v1(20.7,21.34) v1(20.76,18.16) v1(20.76,17.15) v1(20.83,20.32) v1(20.89,16.13) v1(21.21,22.86) v1(21.21,21.84) v1(21.34,20.83) v1(21.34,19.81) v1(21.27,18.67) v1(21.27,17.65) v1(21.4,16.64) v1(21.4,15.62) v1(21.73,23.37) v1(21.72,22.35) v1(21.84,21.34) v1(21.84,20.32) v1(21.78,19.18) v1(21.78,18.16) v1(21.91,17.15) v1(21.91,16.13) v1(21.97,14.99) v1(22.23,23.88) v1(22.24,22.87) v1(22.35,21.84) v1(22.35,20.83) v1(22.29,19.69) v1(22.29,18.67) v1(22.42,17.65) v1(22.42,16.64) v1(22.48,15.49) v1(22.73,23.37) v1(22.86,21.34) v1(22.8,20.19) v1(22.8,19.18) v1(22.88,22.36) v1(22.92,18.16) v1(22.92,17.15) v1(22.99,16) v1(23.37,22.86) v1(23.3,20.7) v1(23.3,19.69) v1(23.39,21.85) v1(23.43,18.67) v1(23.43,17.65) v1(23.49,16.51) v1(23.83,21.21) v1(23.81,20.19) v1(23.88,22.35) v1(23.94,19.18) v1(23.94,18.16) v1(24,17.02) v1(24.32,21.72) v1(24.34,20.71) v1(24.45,19.69) v1(24.45,18.67) v1(24.51,17.53) v1(24.83,21.21) v1(24.96,19.18) v1(24.97,20.2) v1(25.02,18.03) v1(25.46,20.7) v1(25.48,19.69) v1(25.53,18.54) v1(25.97,20.19) v1(26.05,19.06) v1(26.54,19.56) v2(1.4,36.96) v2(1.4,35.18) v2(1.4,33.4) v2(1.4,31.62) v2(1.4,29.85) v2(1.4,28.07) v2(1.4,26.29) v2(1.4,24.51) v2(1.4,22.73) v2(1.4,20.96) v2(1.4,19.18) v2(1.4,17.4) v2(1.4,15.62) v2(1.4,8.51) v2(1.4,3.18) v2(1.4,1.4) v2(3.17,33.4) v2(3.17,26.29) v2(3.17,24.51) v2(3.17,22.73) v2(3.17,20.96) v2(3.17,19.18) v2(3.17,3.18) v2(3.17,1.4) v2(4.95,36.96) v2(4.95,29.85) v2(4.95,26.29) v2(4.95,10.29) v2(4.95,8.51) v2(4.95,3.18) v2(4.95,1.4) v2(6.73,36.96) v2(6.73,29.85) v2(6.73,26.29) v2(6.73,19.18) v2(6.73,12.07) v2(6.73,10.29) v2(6.73,8.51) v2(6.73,6.73) v2(6.73,4.95) v2(6.73,3.18) v2(6.73,1.4) v2(8.51,19.18) v2(8.51,17.4) v2(8.51,10.29) v2(8.51,8.51) v2(8.51,6.73) v2(8.51,4.95) v2(8.51,3.18) v2(8.51,1.14) v2(10.29,36.96) v2(10.29,35.18) v2(10.29,29.85) v2(10.29,28.07) v2(10.29,19.18) v2(10.29,10.29) v2(10.29,6.73) v2(10.29,4.95) v2(10.29,3.18) v2(10.29,1.14) v2(10.67,31.5) v2(12.07,36.96) v2(12.07,22.73) v2(12.07,10.29) v2(12.07,6.73) v2(12.07,4.95) v2(12.07,3.18) v2(12.07,1.14) v2(12.95,37.08) v2(13.84,36.96) v2(13.84,22.73) v2(13.84,13.84) v2(13.84,10.29) v2(13.84,6.73) v2(13.84,4.95) v2(13.84,3.18) v2(13.84,1.14) v2(15.09,19.18) v2(15.42,11.74) v2(15.62,36.96) v2(15.62,35.18) v2(15.62,10.29) v2(15.62,6.73) v2(15.62,4.95) v2(15.62,3.18) v2(15.62,1.14) v2(16.13,33.4) v2(17.13,9.99) v2(17.4,33.4) v2(17.4,31.62) v2(17.4,15.62) v2(17.4,6.73) v2(17.4,1.14) v2(19.18,33.4) v2(19.18,31.62) v2(19.18,29.85) v2(20.95,33.4) v2(20.95,31.62) v2(20.95,29.85) v2(20.95,10.29) v2(22.73,33.4) v2(22.73,12.07) v2(22.73,10.29) v2(22.73,8.51) v2(24.51,33.4) v2(24.51,10.29) v2(24.51,8.51) v2(24.51,7.01) v2(25.92,8.32) v2(26.29,33.4) v2(26.29,31.62) v2(26.29,29.85) v2(26.29,7.01) v2(28.07,33.4) v2(28.07,31.62) v2(28.07,7.01) v2(29.85,33.4) v2(31.65,16.21) v2(32.1,13.92) v2(33.4,31.62) v2(33.4,13.84) v2(33.4,12.07) v2(33.4,6.73) v2(33.83,18.71) v2(35.18,31.62) v2(35.18,26.29) v2(35.18,22.73) v2(35.18,15.62) v2(35.18,13.84) v2(35.18,12.07) v2(35.18,6.73) v2(35.18,1.4) v2(36.96,36.96) v2(36.96,35.18) v2(36.96,31.62) v2(36.96,26.29) v2(36.96,22.73) v2(36.96,15.62) v2(36.96,13.84) v2(36.96,12.07) v2(36.96,1.4) v2(40.51,35.18) v2(40.51,22.73) v2(44.07,36.96) v2(44.07,35.18) v2(44.07,33.4) v2(44.07,31.62) v2(44.07,29.85) v2(44.07,28.07) v2(44.07,26.29) v2(44.07,24.51) v2(44.07,22.73) v2(44.07,15.62) v2(44.07,13.84) v2(44.07,12.07) v2(44.07,10.29) v2(44.07,8.51) v2(44.07,6.73) v2(44.07,4.95) v2(44.07,3.18) v2(44.07,1.4)
D3V3: length 52.8
  Top Layer w0.254: R32.1 v1(16.64,8.17) ; 19.46,15.74 v1(18.11,14.38) 17.53,13.8 17.53,13.72 ; 32.89,16.93 v1(32.89,17.78) ; 27.91,19.94 28.16,20.19 v1(28.58,20.19) ; 22.96,13.97 v1(23.88,13.06) 24.59,12.34 24.59,12.28 ; U4.42 26.29,16.3 v1(26.29,15.88) 26.79,15.37
  Top Layer w0.508: 8.9,24.38 v1(8.9,23.8) v1(8.9,23.15) 8.9,22.65 U3.5
  Inner2 w0.508: v1(18.11,14.38) 17.37,14.38 8.89,22.86 8.89,23.88
  Bottom Layer w0.254: v1(28.58,20.19) 30.48,20.19 v1(32.89,17.78) ; v1(18.11,14.38) 18.11,9.64 v1(16.64,8.17) 16.64,8.26
  Bottom Layer w0.381: v1(28.58,20.19) 26.29,17.91 v1(26.29,15.88) 26.29,15.47 v1(23.88,13.06) 23.22,13.72 18.77,13.72 v1(18.11,14.38)
AIN+: length 4.7
  Top Layer w0.221: 19.42,27.38 19.45,27.38 U4.1
  Top Layer w0.254: 21.23,24.89 21.57,25.23
  Top Layer w0.35: 19.42,27.38 19.41,27.38 18.58,28.21
AIN-: length 4.8
  Top Layer w0.221: 18.65,26.61 18.81,26.61 U4.3
  Top Layer w0.254: U4.3 20.53,24.19 20.52,24.19
  Top Layer w0.35: 18.65,26.61 18.65,26.62 R27.1
CLK+: length 30.5
  Top Layer w0.221: U4.17 15.99,18.63 15.99,18.57 14.87,17.46 14.87,13.58 25.87,2.58 34.43,2.58 34.55,2.47 RN2.1
CLK-: length 29.5
  Top Layer w0.221: RN2.2 34.55,3.12 34.43,3.01 26.05,3.01 15.3,13.76 15.3,17.28 16.29,18.27 16.34,18.27 U4.18
CLKI+: length 3.7
  Top Layer w0.221: RN2.4 36.77,2.47 37.46,1.78 39.07,1.78 39.11,1.81
CLKI-: length 6.4
  Top Layer w0.221: RN2.3 40.34,3.12 H3.12
CLOCKA: length 16.8
  Top Layer w0.221: RN8.2 34.85,5.68 31.95,5.68 27.18,10.45 arc(27.12,10.59) 27.18,10.72 27.33,10.88 arc(27.33,11.15) 27.06,11.15 26.91,10.99 arc(26.77,10.94) 26.64,10.99 26.15,11.48 26.15,14.26 25.02,15.39 25.02,15.45 U4.39
CLOCKB: length 19.6
  Top Layer w0.221: U4.38 24.67,15.09 24.72,15.09 25.43,14.38 25.43,11.16 27,9.59 arc(27.05,9.46) 27,9.32 26.81,9.13 arc(26.81,8.86) 27.08,8.86 27.27,9.05 arc(27.54,9.05) 27.54,8.78 27.35,8.59 arc(27.35,8.32) 27.62,8.32 27.81,8.51 arc(28.08,8.51) 28.08,8.25 27.89,8.06 arc(27.89,7.79) 28.15,7.79 28.34,7.98 arc(28.48,8.03) 28.61,7.98 31.59,5 34.86,5 RN8.1
COA: length 6.4
  Top Layer w0.221: RN8.3 40.34,5.66 H3.10
COB: length 3.7
  Top Layer w0.221: RN8.4 36.77,5.01 37.46,4.32 39.07,4.32 39.11,4.35
DA0: length 3.6
  Top Layer w0.221: RN7.4 36.43,7.55 37.09,6.89 39.11,6.89
DA1: length 6.4
  Top Layer w0.221: RN7.3 40.34,8.2 H3.8
DA2: length 3.7
  Top Layer w0.221: 39.11,9.43 39.07,9.4 37.21,9.4 36.52,10.09 RN6.4
DA3: length 6.4
  Top Layer w0.221: RN6.3 40.34,10.74 H3.6
DA4: length 3.7
  Top Layer w0.221: 39.11,24.32 39.05,24.26 37.21,24.26 36.52,24.95 RN5.4
DA5: length 6.4
  Top Layer w0.221: H1.12 40.36,25.6 RN5.3
DA6: length 3.7
  Top Layer w0.221: RN4.4 36.52,27.49 37.21,26.8 39.05,26.8 39.11,26.86
DA7: length 6.4
  Top Layer w0.221: RN4.3 40.36,28.14 H1.10
DA8: length 3.7
  Top Layer w0.221: 39.11,29.4 39.05,29.34 37.34,29.34 36.65,30.03 RN3.4
DA9: length 6.4
  Top Layer w0.221: H1.8 40.36,30.68 RN3.3
DA10: length 3.7
  Top Layer w0.221: RN1.4 36.9,32.57 37.59,31.88 39.05,31.88 39.11,31.94
DA11: length 6.4
  Top Layer w0.221: H1.6 40.36,33.22 RN1.3
DO0: length 19.5
  Top Layer w0.221: 25.09,16.09 26.92,14.25 26.92,12.7 29.35,10.28 arc(29.4,10.14) 29.35,10.01 29.28,9.94 arc(29.28,9.67) 29.55,9.67 29.95,10.07 arc(30.22,10.07) 30.22,9.8 29.82,9.4 arc(29.82,9.13) 30.09,9.13 30.49,9.53 arc(30.76,9.53) 30.76,9.26 30.36,8.86 arc(30.36,8.59) 30.63,8.6 31.03,9 arc(31.3,9) 31.3,8.73 30.9,8.33 arc(30.9,8.06) 31.17,8.06 31.23,8.12 arc(31.37,8.18) 31.5,8.12 32.08,7.55 RN7.1
DO1: length 16.9
  Top Layer w0.221: U4.43 28.45,14.85 28.45,12.88 28.74,12.59 arc(28.79,12.46) 28.74,12.32 28.65,12.23 arc(28.65,11.96) 28.92,11.96 29.37,12.42 arc(29.64,12.42) 29.64,12.15 29.18,11.69 arc(29.18,11.42) 29.45,11.42 29.91,11.88 arc(30.18,11.88) 30.18,11.61 30.09,11.52 arc(30.03,11.38) 30.09,11.25 33.13,8.2 RN7.2
DO2: length 19.6
  Top Layer w0.221: RN6.1 33.92,10.09 33.64,10.36 arc(33.51,10.42) 33.37,10.36 33.11,10.1 arc(32.84,10.1) 32.84,10.37 33.1,10.63 arc(33.1,10.9) 32.83,10.9 32.57,10.64 arc(32.3,10.64) 32.3,10.91 32.56,11.17 arc(32.56,11.44) 32.29,11.44 32.04,11.18 arc(31.77,11.18) 31.77,11.45 32.02,11.71 arc(32.02,11.98) 31.76,11.98 31.5,11.72 arc(31.23,11.72) 31.23,11.99 31.49,12.25 arc(31.49,12.52) 31.22,12.52 30.96,12.26 arc(30.69,12.26) 30.69,12.53 30.95,12.79 arc(30.95,13.06) 30.68,13.06 30.42,12.8 arc(30.15,12.8) 30.15,13.07 30.41,13.33 arc(30.41,13.6) 30.14,13.6 29.88,13.34 arc(29.61,13.34) 29.61,13.61 29.87,13.87 arc(29.93,14) 29.87,14.13 26.5,17.5
DO3: length 16.8
  Top Layer w0.221: U4.45 29.26,15.45 arc(29.39,15.4) 29.53,15.45 30.06,15.99 arc(30.33,15.99) 30.33,15.72 29.8,15.18 arc(29.8,14.91) 30.07,14.91 30.6,15.45 arc(30.87,15.45) 30.87,15.18 30.34,14.65 arc(30.34,14.38) 30.6,14.38 31.14,14.91 arc(31.41,14.91) 31.41,14.64 30.87,14.11 arc(30.82,13.97) 30.87,13.84 33.97,10.74 RN6.2
DO4: length 19.6
  Top Layer w0.221: U4.46 28.27,17.15 31.04,17.15 32.83,18.94 32.83,19.74 arc(32.89,19.87) 33.02,19.93 33.7,19.93 arc(33.89,20.12) 33.7,20.31 33.02,20.31 arc(32.83,20.5) 33.02,20.69 33.7,20.69 arc(33.89,20.88) 33.7,21.07 33.02,21.07 arc(32.83,21.26) 33.02,21.45 33.7,21.45 arc(33.89,21.64) 33.7,21.83 33.02,21.83 arc(32.89,21.89) 32.83,22.02 32.83,22.84 33.21,23.22 arc(33.35,23.28) 33.48,23.22 33.55,23.16 arc(33.82,23.16) 33.82,23.43 33.75,23.49 arc(33.7,23.63) 33.75,23.76 34.87,24.88 RN5.1
DO5: length 16.9
  Top Layer w0.221: RN5.2 34.51,25.6 31.52,22.61 31.52,21.75 arc(31.57,21.61) 31.71,21.56 31.93,21.56 arc(32.12,21.37) 31.93,21.18 31.1,21.18 arc(30.91,20.99) 31.1,20.79 31.93,20.79 arc(32.12,20.6) 31.93,20.41 31.1,20.41 arc(30.91,20.22) 31.1,20.03 31.32,20.03 arc(31.46,19.98) 31.52,19.84 31.52,19.28 30.02,17.78 28.35,17.78 U4.47
DO6: length 19.6
  Top Layer w0.221: 27.91,18.92 28.16,18.67 29.08,18.67 30.23,19.81 30.23,20.39 arc(30.17,20.53) 30.04,20.59 29.52,20.59 arc(29.33,20.78) 29.52,20.97 30.04,20.97 arc(30.23,21.16) 30.04,21.35 29.52,21.35 arc(29.33,21.54) 29.52,21.73 30.04,21.73 arc(30.17,21.78) 30.23,21.92 30.23,22.99 30.63,23.39 arc(30.76,23.44) 30.9,23.39 31.04,23.25 arc(31.31,23.25) 31.31,23.52 31.17,23.66 arc(31.17,23.93) 31.44,23.93 31.58,23.79 arc(31.85,23.79) 31.85,24.06 31.71,24.2 arc(31.71,24.47) 31.97,24.47 32.12,24.33 arc(32.38,24.33) 32.39,24.6 32.24,24.74 arc(32.24,25.01) 32.51,25.01 32.65,24.86 arc(32.92,24.86) 32.92,25.13 32.78,25.27 arc(32.78,25.54) 33.05,25.54 33.19,25.4 arc(33.46,25.4) 33.46,25.67 33.32,25.81 arc(33.27,25.95) 33.32,26.08 34.73,27.49 RN4.1
DO7: length 16.8
  Top Layer w0.221: RN4.2 33.22,28.14 32.63,27.55 arc(32.58,27.42) 32.63,27.28 32.85,27.07 arc(32.85,26.8) 32.58,26.8 32.36,27.01 arc(32.09,27.01) 32.09,26.75 32.31,26.53 arc(32.31,26.26) 32.04,26.26 31.83,26.48 arc(31.56,26.48) 31.56,26.21 31.77,25.99 arc(31.77,25.72) 31.5,25.72 31.29,25.94 arc(31.02,25.94) 31.02,25.67 31.23,25.45 arc(31.23,25.18) 30.96,25.18 30.75,25.4 arc(30.48,25.4) 30.48,25.13 30.69,24.91 arc(30.69,24.64) 30.42,24.64 30.21,24.86 arc(30.07,24.91) 29.94,24.86 29.59,24.51 29.59,23.04 U4.51
DO8: length 19.6
  Top Layer w0.221: RN3.1 33.46,30.03 32.05,28.62 arc(31.91,28.56) 31.78,28.62 31.7,28.7 arc(31.43,28.7) 31.43,28.43 31.86,28 arc(31.86,27.73) 31.59,27.73 31.16,28.16 arc(30.89,28.16) 30.89,27.89 31.32,27.46 arc(31.32,27.19) 31.05,27.19 30.62,27.62 arc(30.35,27.62) 30.35,27.35 30.78,26.92 arc(30.78,26.65) 30.51,26.65 30.08,27.09 arc(29.81,27.08) 29.81,26.82 30.24,26.38 arc(30.24,26.11) 29.98,26.11 29.89,26.2 arc(29.76,26.25) 29.62,26.2 28.96,25.53 28.96,23.11 U4.52
DO9: length 16.8
  Top Layer w0.221: RN3.2 32.71,30.68 30.94,28.9 arc(30.8,28.85) 30.67,28.9 30.49,29.08 arc(30.22,29.08) 30.22,28.81 30.4,28.63 arc(30.4,28.37) 30.13,28.37 29.95,28.54 arc(29.68,28.54) 29.68,28.27 29.86,28.1 arc(29.86,27.83) 29.59,27.83 29.41,28 arc(29.14,28) 29.14,27.73 29.32,27.56 arc(29.38,27.42) 29.32,27.29 28.19,26.16 28.19,23.05 26.5,21.36
DO10: length 19.6
  Top Layer w0.221: U4.54 27.3,22.87 27.3,27.05 28.01,27.76 arc(28.07,27.89) 28.01,28.03 27.82,28.22 arc(27.82,28.49) 28.09,28.49 28.28,28.3 arc(28.55,28.3) 28.55,28.57 28.36,28.76 arc(28.36,29.03) 28.63,29.03 28.82,28.84 arc(29.09,28.84) 29.09,29.11 28.9,29.3 arc(28.9,29.57) 29.17,29.57 29.36,29.38 arc(29.63,29.38) 29.63,29.65 29.44,29.84 arc(29.44,30.11) 29.71,30.11 29.9,29.92 arc(30.03,29.86) 30.17,29.92 32.82,32.57 RN1.1
DO11: length 16.8
  Top Layer w0.221: RN1.2 31.57,33.22 26.42,28.07 26.42,22.69 U4.55
OFA: length 31.2
  Top Layer w0.254: U4.56 25.78,22.76 v1(25.78,23.37) ; R1.1 v1(16.76,3.97)
  Inner2 w0.254: v1(16.76,3.97) 19.56,6.76 19.56,10.67 22.73,13.84 23.49,13.84 29.46,19.81 29.46,22.86 28.32,24 26.42,24 v1(25.78,23.37)
VCM: length 18.1
  Top Layer w0.254: C6.2 v1(14.56,28.15) 15.61,29.2 U1.9 ; U4.60 24.38,24.19 24.38,25.72 v1(25.02,26.36) 25.02,27.3
  Bottom Layer w0.254: v1(14.56,28.15) 14.65,28.07 24,28.07 25.02,27.05 v1(25.02,26.36)
$1N11576: length 3.7
  Top Layer w0.254: 19.46,23.13 19.11,22.77 17.88,24 17.27,24 16.64,24.63 C1.1
$1N11577: length 3.9
  Top Layer w0.254: C2.2 16.39,23.11 17.35,23.11 U4.10 U4.9
$1N11578: length 6.7
  Top Layer w0.254: 17.4,25.4 C1.2 ; 17.4,25.4 18.03,24.77 18.53,24.77 U4.6 U4.5 ; 17.4,25.4 16.64,26.16 ; 16.64,26.16 C3.2 ; 16.64,26.16 16.38,26.42 C5.2
$1N11579: length 7
  Top Layer w0.254: C5.1 14.09,23.87 14.25,23.72 ; 18.05,21.71 17.7,21.36 16.7,22.35 15.61,22.35 C2.1 14.25,23.72 ; 14.25,23.72 C4.1
$1N11586: length 1.8
  Top Layer w0.221: 13.88,34.27 13.88,34.14 14.14,33.88 14.14,32.93 14.42,32.65
$1N11587: length 3.1
  Top Layer w0.221: U1.2 13.56,32.81 13.56,33.39 R5.2
  Top Layer w0.348: R5.2 13.11,33.7 12.35,34.46
$1N11588: length 1.8
  Top Layer w0.221: 11.74,32.18 12.03,31.89 13.07,31.89 13.29,31.67 13.33,31.67
$1N11590: length 3.1
  Top Layer w0.221: R7.2 12.71,32.43 13.24,32.43 13.84,31.83
  Top Layer w0.348: 11.59,33.7 12.35,32.94 R7.2
$1N11617: length 9.9
  Top Layer w0.254: 25.02,30.74 v1(24.34,30.74) 23.66,30.74 ; v1(25.65,24.13) 25.65,24.05 U4.58
  Bottom Layer w0.254: v1(24.34,30.74) 24.34,29 25.65,27.69 v1(25.65,24.13)
$1N11646: length 5.7
  Top Layer w0.348: 10.98,34.31 10.09,33.42 ; 5.86,33.84 6.28,33.42 10.09,33.42
$1N11649: length 2.2
  Top Layer w0.221: 17.2,28.06 17.2,28.47 U1.10
$1N11650: length 2.2
  Top Layer w0.221: R26.2 17.55,28.83 U1.11
$1N13030: length 3.5
  Top Layer w0.254: 10.22,15.21 11.15,15.21 11.66,15.73 12.24,15.73 12.24,14.43
$1N13493: length 3.6
  Top Layer w0.221: 6.65,18.02 6.33,17.71 6.33,15.65 6.77,15.21 U2.6
$1N13643: length 4.2
  Top Layer w0.508: 4.32,24.38 4.32,22.73 L2.1 6.71,22.64 U3.1
$1N14199: length 1.3
  Top Layer w0.348: 11.74,35.07 12.63,35.96
$1N14652: length 1.7
  Top Layer w0.254: LED1.2 13.06,3.97 R1.2
$1N14739: length 1.7
  Top Layer w0.254: LED2.2 14.8,8.17 R32.2

## Copper pours and planes (outline as drawn; the poured copper is in the pictures)
3V3 on Top Layer: 11.42,30.81 14.96,30.81 14.96,28.15 11.42,28.15
3V3 on Top Layer: 9.01,14.74 12.79,14.74 12.79,10.88 9.01,10.88
3V3 on Top Layer: 13.37,22.32 17.65,22.32 17.65,19.99 13.37,19.99
3V3 on Top Layer: 22.63,27.85 23.72,27.85 23.72,24.18 22.63,24.18
AGND on Top Layer: -0.13,38.86 46.23,38.86 46.23,-0.13 -0.13,-0.13
AGND on Bottom Layer: -0.76,39.37 46.39,39.37 46.39,-0.38 -0.76,-0.38
AGND on Inner1: -0.38,38.99 46.23,38.99 46.23,-0.38 -0.38,-0.38
AGND on Inner2: 0,38.86 46.36,38.86 46.36,-0.13 0,-0.13
$1N12931 on Top Layer: 1.42,16.38 7.64,16.38 7.64,13.17 1.42,13.17

Small or netless copper shapes (teardrops, artwork), in the pictures only: 303 on Top Layer, 19 on Bottom Layer, 8 on Inner2

## Text on the board
Bottom Silkscreen Layer: NUMBER | NC | GND | DA11/10 | DA9/8 | DA7/6 | DA5/4 | DA3/2 | DA1/0 | COA/B | CLKN/P
Top Silkscreen Layer: VCM | MAX:±1V | 5V  G | Over Range | Power Good | Pmode 外长19.5mm 内长15mm / 外比内长88.5mil即可 / 外916.5 内828
